# Altium schematic sheet Sheet_MAGJACK.SchDoc
size A4
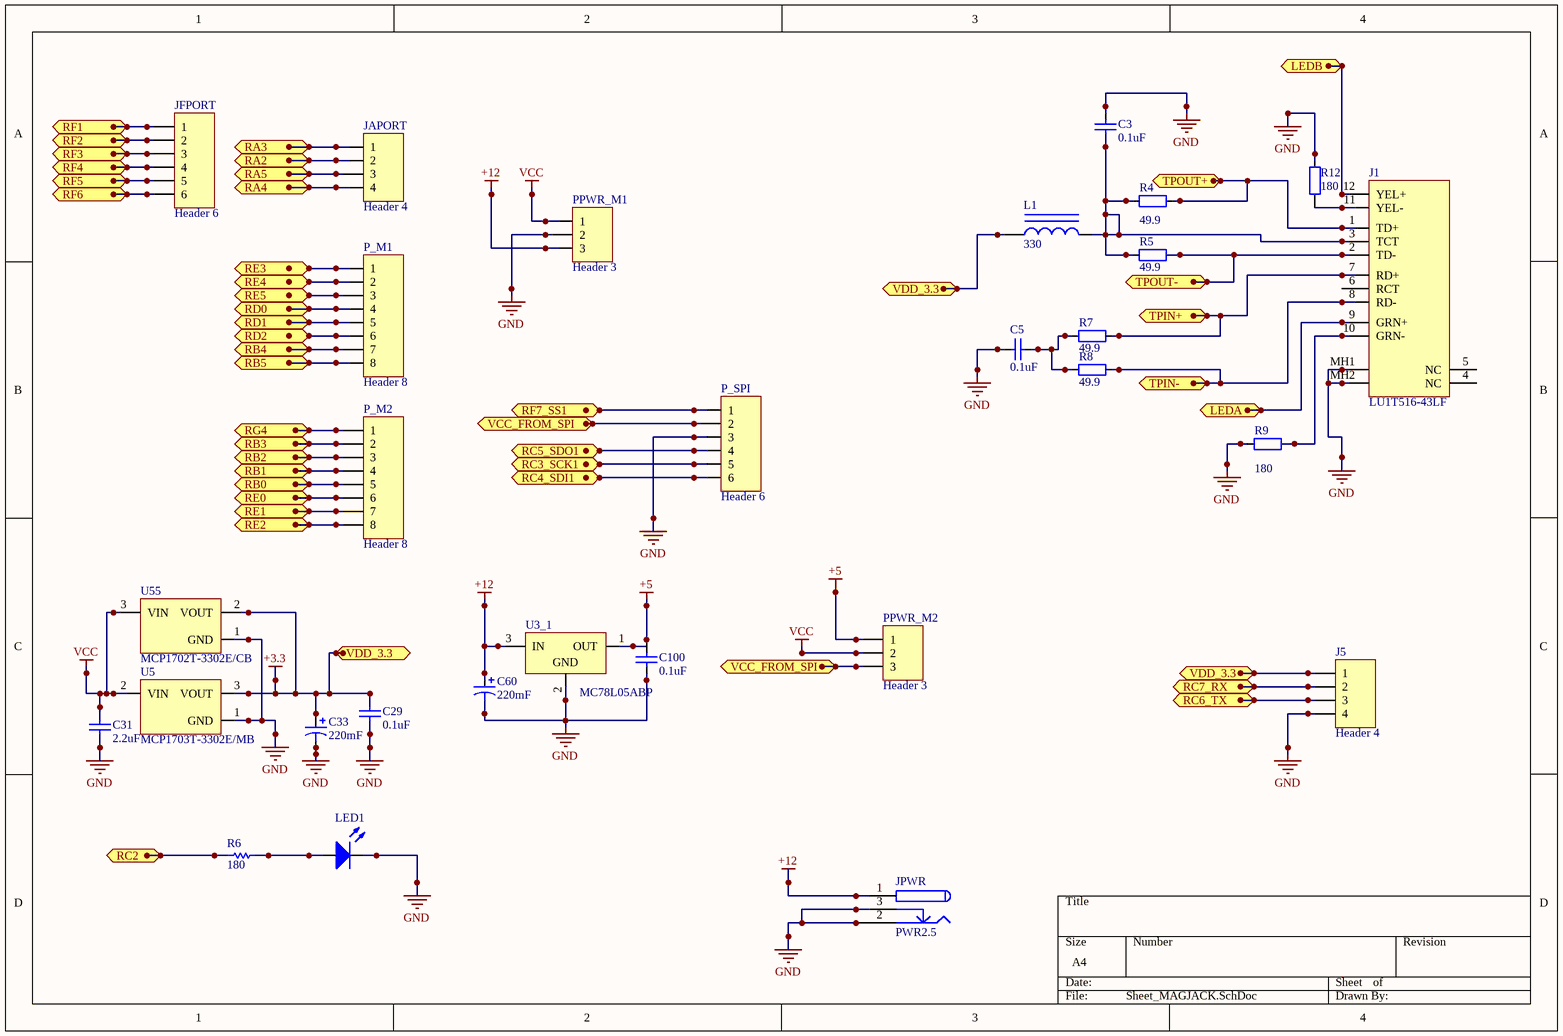
[diagram p0: Sheet_MAGJACK.SchDoc]

## Parts
C3  0.1uF  [CAPC2012L]
C5  0.1uF  [CAPC2012L]
C29  0.1uF  [CAPC2012L]
C31  2.2uF  [CAPC3216L]
C33  220mF  [CAPPR5-10x12.5]
C60  220mF  [CAPPR5-10x12.5]
C100  0.1uF  [CAPC2012L]
J1  LU1T516-43LF  [CON_RJ45_RA_LEDS]
J5  Header 4  [HDR1X4]
JAPORT  Header 4  [HDR1X4]
JFPORT  Header 6  [HDR1X6]
JPWR  PWR2.5  [KLD-0202]
L1  330  [RESC2012L]
LED1  LED2  [CAPC2012L]  (value not drawn)
P_M1  Header 8  [HDR1X8]
P_M2  Header 8  [HDR1X8]
P_SPI  Header 6  [HDR1X6]
PPWR_M1  Header 3  [HDR1X3]
PPWR_M2  Header 3  [HDR1X3]
R4  49.9  [RESC2012L]
R5  49.9  [RESC2012L]
R6  180  [RESC2012L]
R7  49.9  [RESC2012L]
R8  49.9  [RESC2012L]
R9  180  [RESC2012L]
R12  180  [RESC2012L]
U3_1  MC78L05ABP  [29-04]
U5  MCP1703T-3302E/MB  [SOT-89-MB3_N]
U55  MCP1702T-3302E/CB  [SOT-23A-CB3_N]

## Ports
LEDA, LEDB, RA2, RA3, RA4, RA5, RB0, RB1, RB2, RB3, RB4, RB5, RC2, RC3_SCK1, RC4_SDI1, RC5_SDO1, RC6_TX, RC7_RX, RD0, RD1, RD2, RE0, RE1, RE2, RE3, RE4, RE5, RF1, RF2, RF3, RF4, RF5, RF6, RF7_SS1, RG4, TPIN+, TPIN-, TPOUT+, TPOUT-, VCC_FROM_SPI, VDD_3.3

## Nets
+3.3: C29.2 C33.1 J5.1 L1.1 U5.3(VOUT) U55.2(VOUT) ; port VDD_3.3
+5: C100.2 PPWR_M2.1 U3_1.1(OUT)
+12: C60.1 JPWR.1 JPWR.1A JPWR.1B PPWR_M1.3 U3_1.3(IN)
GND: C3.2 C5.1 C29.1 C31.1 C33.2 C60.2 C100.1 J1.MH1 J1.MH2 J5.4 JPWR.2 JPWR.2A JPWR.2B JPWR.3 JPWR.3A JPWR.3B LED1.2(K) P_SPI.3 PPWR_M1.2 R9.1 R12.2 U3_1.2(GND) U5.1(GND) U55.1(GND)
VCC: C31.2 PPWR_M1.1 PPWR_M2.2 U5.2(VIN) U55.3(VIN)
LEDA: J1.9(GRN+) ; port LEDA
LEDB: J1.12(YEL+) ; port LEDB
RA2: JAPORT.2 ; port RA2
RA3: JAPORT.1 ; port RA3
RA4: JAPORT.4 ; port RA4
RA5: JAPORT.3 ; port RA5
RB0: P_M2.5 ; port RB0
RB1: P_M2.4 ; port RB1
RB2: P_M2.3 ; port RB2
RB3: P_M2.2 ; port RB3
RB4: P_M1.7 ; port RB4
RB5: P_M1.8 ; port RB5
RC2: R6.1 ; port RC2
RC3_SCK1: P_SPI.5 ; port RC3_SCK1
RC4_SDI1: P_SPI.6 ; port RC4_SDI1
RC5_SDO1: P_SPI.4 ; port RC5_SDO1
RC6_TX: J5.3 ; port RC6_TX
RC7_RX: J5.2 ; port RC7_RX
RD0: P_M1.4 ; port RD0
RD1: P_M1.5 ; port RD1
RD2: P_M1.6 ; port RD2
RE0: P_M2.6 ; port RE0
RE1: P_M2.7 ; port RE1
RE2: P_M2.8 ; port RE2
RE3: P_M1.1 ; port RE3
RE4: P_M1.2 ; port RE4
RE5: P_M1.3 ; port RE5
RF1: JFPORT.1 ; port RF1
RF2: JFPORT.2 ; port RF2
RF3: JFPORT.3 ; port RF3
RF4: JFPORT.4 ; port RF4
RF5: JFPORT.5 ; port RF5
RF6: JFPORT.6 ; port RF6
RF7_SS1: P_SPI.1 ; port RF7_SS1
RG4: P_M2.1 ; port RG4
TPIN+: J1.7(RD+) R7.2 ; port TPIN+
TPIN-: J1.8(RD-) R8.2 ; port TPIN-
TPOUT+: J1.1(TD+) R4.2 ; port TPOUT+
TPOUT-: J1.2(TD-) R5.2 ; port TPOUT-
VCC_FROM_SPI: P_SPI.2 PPWR_M2.3 ; port VCC_FROM_SPI
NetC3_1: C3.1 J1.3(TCT) L1.2 R4.1 R5.1
NetC5_2: C5.2 R7.1 R8.1
NetJ1_10: J1.10(GRN-) R9.2
NetJ1_11: J1.11(YEL-) R12.1
NetLED1_1: LED1.1(A) R6.2

Not connected (* = marked no-connect by the designer): J1 4(NC) 5(NC) 6(RCT)

## Library data of the parts
C3 C5 C29 C31 = Cap: Capacitor; Published: 8-Jun-2000; LatestRevisionDate: 17-Jul-2002; LatestRevisionNote: Re-released for DXP Platform.; PackageReference: RAD-0.3; Publisher: Altium Limited
  C3 C5 C29: Value: 0.1uF
  C31: Value: 2.2uF
C33 C60 = Cap Pol1: Polarized Capacitor (Radial); Published: 8-Jun-2000; LatestRevisionDate: 17-Jul-2002; LatestRevisionNote: Re-released for DXP Platform.; PackageReference: RB7.6-15; Publisher: Altium Limited; Value: 220mF
C100 = Cap Semi: Capacitor (Semiconductor SIM Model); Published: 8-Jun-2000; LatestRevisionDate: 29-May-2009; LatestRevisionNote: IPC-7351 Footprint Added.; PackageReference: C1206; Publisher: Altium Limited; PackageDescription: Chip Capacitor; Value: 0.1uF
J1 = Component_1
J5 JAPORT = Header 4: Header, 4-Pin; LatestRevisionDate: 17-Jul-2002; LatestRevisionNote: Re-released for DXP Platform.; Publisher: Altium Limited
JFPORT P_SPI = Header 6: Header, 6-Pin; LatestRevisionDate: 17-Jul-2002; LatestRevisionNote: Re-released for DXP Platform.; Publisher: Altium Limited
JPWR = PWR2.5: DC Power Jack, 2.5mm, KLD Series, PCB Mount; Published: 5-Jan-2004; DatasheetDocument: 09-May-2002; Publisher: Altium Limited
L1 = Inductor Iron: Magnetic-Core Inductor; Published: 24-Mar-1999; LatestRevisionDate: 17-Jul-2002; LatestRevisionNote: Re-released for DXP Platform.; PackageReference: AXIAL-0.9; Publisher: Altium Limited; Value: 330
LED1 = LED2: Typical RED, GREEN, YELLOW, AMBER GaAs LED; Published: 8-Jun-2000; LatestRevisionDate: 17-Jul-2002; LatestRevisionNote: Re-released for DXP Platform.; PackageReference: 3.2X1.6X1.1; Publisher: Altium Limited; PackageVersion: Feb-2002
P_M1 P_M2 = Header 8: Header, 8-Pin; LatestRevisionDate: 17-Jul-2002; LatestRevisionNote: Re-released for DXP Platform.; Publisher: Altium Limited
PPWR_M1 PPWR_M2 = Header 3: Header, 3-Pin; LatestRevisionDate: 17-Jul-2002; LatestRevisionNote: Re-released for DXP Platform.; Publisher: Altium Limited
R4 R5 R7-R9 R12 = Res2: Resistor; Published: 8-Jun-2000; LatestRevisionDate: 17-Jul-2002; LatestRevisionNote: Re-released for DXP Platform.; PackageReference: AXIAL-0.4; Publisher: Altium Limited
  R4 R5 R7 R8: Value: 49.9
  R9 R12: Value: 180
R6 = Res Semi: Semiconductor Resistor; Published: 8-Jun-2000; LatestRevisionDate: 17-Jul-2002; LatestRevisionNote: Re-released for DXP Platform.; PackageReference: AXIAL-0.5; Publisher: Altium Limited; Value: 180
U3_1 = MC78L05ABP: Three-Terminal Low Current Positive Voltage Regulator; Published: 15-Apr-2002; DatasheetVersion: Oct-1999; PackageVersion: 1996; PackageReference: 29-04; Publisher: Altium Limited; PackageDescription: TO, Flat Index; 3 In-Line, Axial Leads; Body Dia. 4.8mm; Leads 0.48 x 0.51 mm (max); ComponentLink1Description: Manufacturer Link; ComponentLink1URL: http://www.onsemi.com/site/products/taxonomy/0,4438,503,00.html; ComponentLink2Description: Datasheet; ComponentLink2URL: http://www.onsemi.com/pub/Collateral/MC78L00A-D.PDF
U5 = MCP1703T-3302E/MB: 250 mA, 16V, Low Quiescent Current LDO Regulator, 3-Pin SOT-89, Extended Temperature, Tape and Reel; FirstPublished: 29-Jan-2009; DatasheetVersion: revD, Sep-2009; PackageVersion: revBB, Aug-2009; PackageReference: SOT-89-MB3; Publisher: Altium Limited; PackageDescription: 3-Lead Plastic Small Outline Transistor Header (MB) [SOT-89]; Supplier 1: Digi-Key; Supplier Part Number 1: MCP1703T-3302E/MBTR-ND; Supplier 2: Digi-Key; Supplier Part Number 2: MCP1703T-3302E/MBCT-ND; Supplier 3: Digi-Key; Supplier Part Number 3: MCP1703T-3302E/MBDKR-ND; Supplier 4: Newark; Supplier Part Number 4: 40M0639; Code_IPC: SOT89; ComponentLink1Description: Datasheet; ComponentLink1URL: http://ww1.microchip.com/downloads/en/DeviceDoc/22049d.pdf; ComponentLink2Description: Packaging Specification; ComponentLink2URL: http://www.microchip.com/stellent/groups/techpub_sg/documents/packagingspec/en012702.pdf; ComponentLink3Description: Microchip.com Home; ComponentLink3URL: http://www.microchip.com/
U55 = MCP1702T-3302E/CB: 250 mA Low Quiescent Current LDO Regulator, 3-Pin SOT-23A, Extended Temperature, Tape and Reel; FirstPublished: 29-Jan-2009; LatestRevisionDate: 02-Dec-2009; LatestRevisionNote: Updated to datasheet revision D, Jun-2009; DatasheetVersion: revD, Jun-2009; PackageVersion: revBB, Aug-2009; PackageReference: SOT-23A-CB3; Publisher: Altium Limited; PackageDescription: 3-Lead Plastic Small Outline Transistor (CB) [SOT-23A]; Supplier 1: Digi-Key; Supplier Part Number 1: MCP1702T-3302E/CBTR-ND; Supplier 2: Digi-Key; Supplier Part Number 2: MCP1702T-3302E/CBCT-ND; Supplier 3: Digi-Key; Supplier Part Number 3: MCP1702T-3302E/CBDKR-ND; Supplier 4: Farnell; Supplier Part Number 4: 1331490; Supplier 5: Newark; Supplier Part Number 5: 56K6992; ComponentLink1Description: Datasheet; ComponentLink1URL: http://ww1.microchip.com/downloads/en/DeviceDoc/22008d.pdf; ComponentLink2Description: Packaging Specification; ComponentLink2URL: http://www.microchip.com/stellent/groups/techpub_sg/documents/packagingspec/en012702.pdf; ComponentLink3Description: Microchip.com Home; ComponentLink3URL: http://www.microchip.com/